# Altium schematic sheet AMP_MAIN_REV1.0.SchDoc
size A4
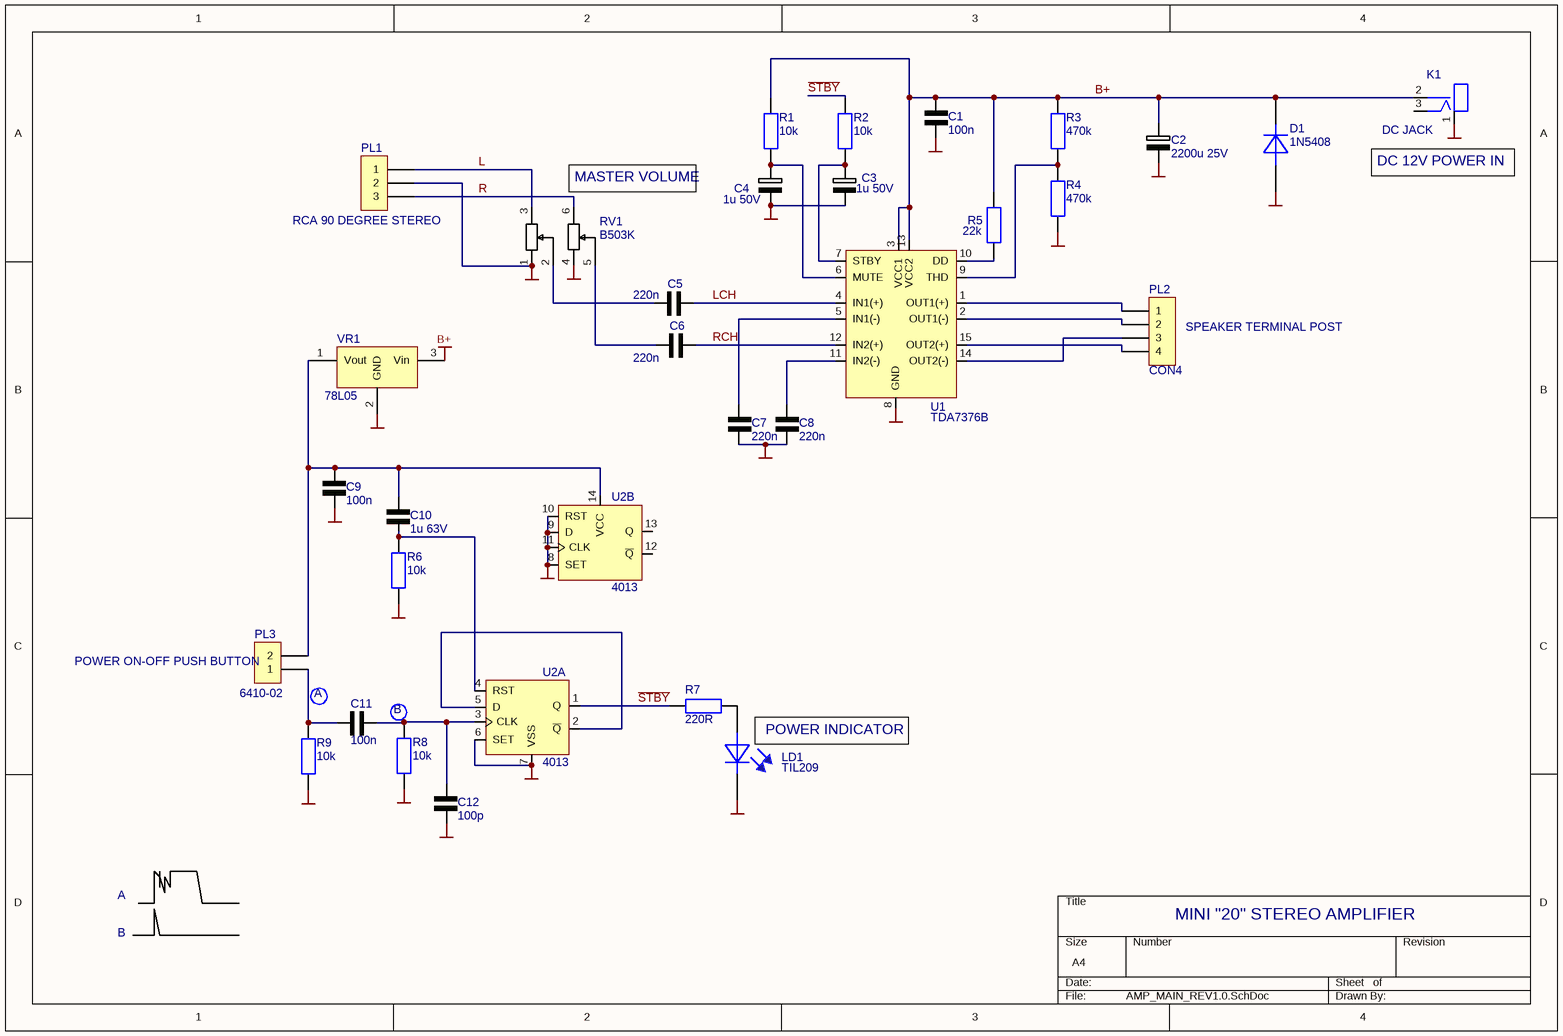
[diagram p0: AMP_MAIN_REV1.0.SchDoc]

## Parts
C1  100n  [CAP200]
C2  2200u 25V  [CAP RADIAL 13/26]
C3  1u 50V  [CAP PF 5.08/6.5]
C4  1u 50V  [CAP PF 5.08/6.5]
C5  220n  [CAP POLY 5.08/7.5/2.5]
C6  220n  [CAP POLY 5.08/7.5/2.5]
C7  220n  [CAP POLY 5.08/7.5/2.5]
C8  220n  [CAP POLY 5.08/7.5/2.5]
C9  100n  [CAP200]
C10  1u 63V  [WIMA MKS 2]
C11  100n  [CAP200]
C12  100p  [CAP200]
D1  1N5408  [DIODE 1N5408]
K1  DC JACK  [DC JACK]
LD1  TIL209  [LED_RA_5MM]
PL1  RCA 90 DEGREE STEREO  [RCA_STEREO_PCB_VERTICAL]
PL2  CON4  [SPEAKER_TERMINAL_PCB]
PL3  6410-02  [CON MOLEX 6410 2 WAY]
R1  10k  [RES 1/4W H]
R2  10k  [RES 1/4W H]
R3  470k  [RES 1/4W H]
R4  470k  [RES 1/4W H]
R5  22k  [RES 1/4W H]
R6  10k  [RES 1/4W H]
R7  220R  [RES 1/4W H]
R8  10k  [RES 1/4W H]
R9  10k  [RES 1/4W H]
RV1  B503K  [ALPS 043R]
U1  TDA7376B  [MULTIWATT15V]
U2  4013  [DIP 14]  (parts A,B of 2)
VR1  78L05  [TO92_REGULATOR]

## Nets
B+: C1.2 C2.1 D1.2(K) K1.2 R1.2 R3.2 R5.2 U1.3(VCC1) U1.13(VCC2) VR1.3(Vin)
GND: C1.1 C2.2 C3.2 C4.2 C7.1 C8.1 C9.2 C12.2 D1.1(A) K1.1 LD1.K PL1.2 R4.1 R6.1 R8.1 R9.1 RV1.1(A) RV1.4(A) U1.8(GND) U2.6(SET) U2.7(VSS) U2.8(SET) U2.9(D) U2.10(RST) U2.11(CLK) VR1.2(GND)
~{STBY}: R2.2 R7.2 U2.1(Q)
L: PL1.1 RV1.3(B)
LCH: C5.2 U1.4(IN1(+))
R: PL1.3 RV1.6(B)
RCH: C6.2 U1.12(IN2(+))
NetC3_1: C3.1 R2.1 U1.7(STBY)
NetC4_1: C4.1 R1.1 U1.6(MUTE)
NetC5_1: C5.1 RV1.2(W)
NetC6_1: C6.1 RV1.5(W)
NetC7_2: C7.2 U1.5(IN1(-))
NetC8_2: C8.2 U1.11(IN2(-))
NetC9_1: C9.1 C10.1 PL3.2 U2.14(VCC) VR1.1(Vout)
NetC10_2: C10.2 R6.2 U2.4(RST)
NetC11_1: C11.1 PL3.1 R9.2
NetC11_2: C11.2 C12.1 R8.2 U2.3(CLK)
NetLD1_A: LD1.A R7.1
NetPL2_1: PL2.1 U1.1(OUT1(+))
NetPL2_2: PL2.2 U1.2(OUT1(-))
NetPL2_3: PL2.3 U1.14(OUT2(-))
NetPL2_4: PL2.4 U1.15(OUT2(+))
NetR3_1: R3.1 R4.2 U1.9(THD)
NetR5_1: R5.1 U1.10(DD)
NetU2_2: U2.2(~{Q}) U2.5(D)

Not connected (* = marked no-connect by the designer): K1 3; U2 12(~{Q}) 13(Q)

## Notes on the sheet
- (near RV1) MASTER VOLUME
- (near K1) DC 12V POWER IN
- (near PL2) SPEAKER TERMINAL POST
- POWER ON-OFF PUSH BUTTON
- A
- B
- (near LD1) POWER INDICATOR
- MINI "20" STEREO AMPLIFIER

## Library data of the parts
C1 C5-C12 = CAPACITOR
C2-C4 = POL_CAP
D1 = STD_DIODE
LD1 = STD_LED
PL1 = CON3: 3 Way Connector; SAP Code: *; 1st Manf.: *; 1st Manf. Part #: *; 1st Manf. Package type: *; 1st Vendor: *; 1st Vendor Part #: *; 1st Vendor Leadtime: *; 1st Vendor Standard Cost: *; 2nd Manf.: *; 2nd Manf. Part #: *; 2nd Manf. Package type: *; 2nd Vendor: *; 2nd Vendor Part #: *; 2nd Vendor Leadtime: *; 2nd Vendor Standard Cost: *; *: *
PL2 = CON4: 4 Way Connector; SAP Code: *; 1st Manf.: *; 1st Manf. Part #: *; 1st Manf. Package type: *; 1st Vendor: *; 1st Vendor Part #: *; 1st Vendor Leadtime: *; 1st Vendor Standard Cost: *; 2nd Manf.: *; 2nd Manf. Part #: *; 2nd Manf. Package type: *; 2nd Vendor: *; 2nd Vendor Part #: *; 2nd Vendor Leadtime: *; 2nd Vendor Standard Cost: *; *: *
PL3 = CON2: 2 Way connector; SAP Code: *; 1st Manf.: *; 1st Manf. Part #: *; 1st Manf. Package type: *; 1st Vendor: *; 1st Vendor Part #: *; 1st Vendor Leadtime: *; 1st Vendor Standard Cost: *; 2nd Manf.: *; 2nd Manf. Part #: *; 2nd Manf. Package type: *; 2nd Vendor: *; 2nd Vendor Part #: *; 2nd Vendor Leadtime: *; 2nd Vendor Standard Cost: *; *: *
R1-R9 = RES
RV1 = POT DUAL GANGED
U1 = TDA7376: Stereo 35W Automotive Power Amplifier
U2 = 4013: FLIP-FLOP
VR1 = REG 78LXX: Low power fixed voltage regulator; SAP Code: *; 1st Manf.: *; 1st Manf. Part #: *; 1st Manf. Package type: *; 1st Vendor: *; 1st Vendor Part #: *; 1st Vendor Leadtime: *; 1st Vendor Standard Cost: *; 2nd Manf.: *; 2nd Manf. Part #: *; 2nd Manf. Package type: *; 2nd Vendor: *; 2nd Vendor Part #: *; 2nd Vendor Leadtime: *; 2nd Vendor Standard Cost: *; *: *